# EAGLE design ardu_battle_2 (EAGLE 5.10)
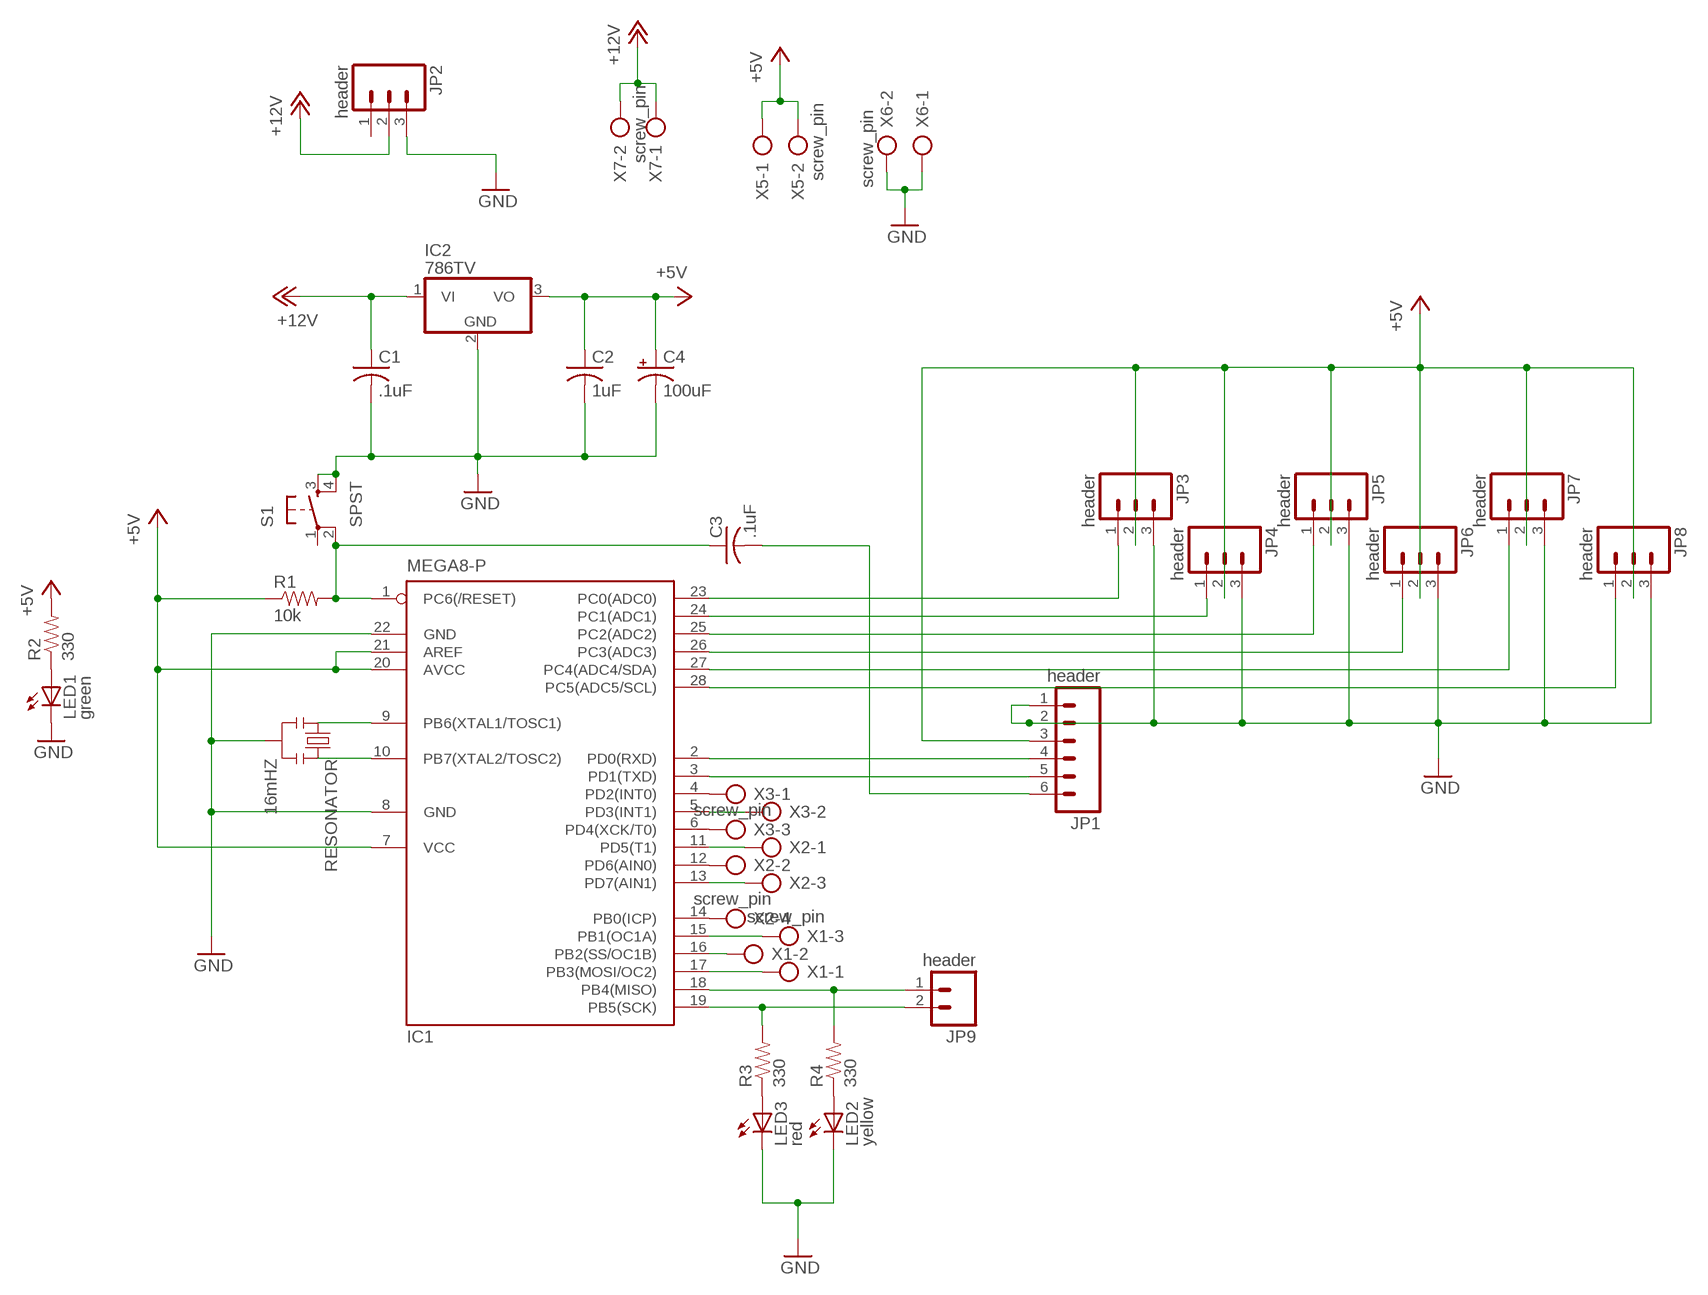
[diagram p0: schematic, sheet 1]

## Parts
C1  .1uF  C-US025-030X050  [C025-030X050]
C2  1uF  C-US025-030X050  [C025-030X050]
C3  .1uF  C-US075-032X103  [C075-032X103]
C4  100uF  CPOL-USE5-6  [E5-6]
IC1  MEGA8-P  [DIL28-3]
IC2  786TV  [TO220V]
JP1  header  M06SIP  [1X06]
JP2  header  M03PTH  [1X03]
JP3  header  M03PTH  [1X03]
JP4  header  M03PTH  [1X03]
JP5  header  M03PTH  [1X03]
JP6  header  M03PTH  [1X03]
JP7  header  M03PTH  [1X03]
JP8  header  M03PTH  [1X03]
JP9  header  M02PTH  [1X02]
LED1  green  LED3MM  [LED3MM]
LED2  yellow  LED3MM  [LED3MM]
LED3  red  LED3MM  [LED3MM]
R1  10k  RESISTORPTH-1/6W  [1/6W-RES]
R2  330  RESISTORPTH-1/6W  [1/6W-RES]
R3  330  RESISTORPTH-1/6W  [1/6W-RES]
R4  330  RESISTORPTH-1/6W  [1/6W-RES]
RESONATOR  16mHZ  RESONATORPTH  [RESONATOR-PTH]
S1  SPST  TAC_SWITCHPTH  [TACTILE-PTH]
X1  screw_pin  AK500/3  [AK500/3]
X2  screw_pin  AK500/4  [AK500/4]
X3  screw_pin  AK500/3  [AK500/3]
X5  screw_pin  AK500/2  [AK500/2]
X6  screw_pin  AK500/2  [AK500/2]
X7  screw_pin  AK500/2  [AK500/2]

## Nets
+5V: C2.1 C4.+ IC1.7(VCC) IC1.20(AVCC) IC1.21(AREF) IC2.3(VO) JP1.3 JP3.2 JP4.2 JP5.2 JP6.2 JP7.2 JP8.2 R1.1 R2.2 X5.1 X5.2
+12V: C1.1 IC2.1(VI) JP2.2 X7.1 X7.2
GND: C1.2 C2.2 C4.- IC1.8(GND) IC1.22(GND) IC2.2(GND) JP1.1 JP1.2 JP2.3 JP3.3 JP4.3 JP5.3 JP6.3 JP7.3 JP8.3 LED1.K(C) LED2.K(C) LED3.K(C) RESONATOR.2 S1.3 S1.4 X6.1 X6.2
N$1: IC1.10(PB7(XTAL2/TOSC2)) RESONATOR.3
N$2: IC1.9(PB6(XTAL1/TOSC1)) RESONATOR.1
N$3: IC1.23(PC0(ADC0)) JP3.1
N$4: IC1.24(PC1(ADC1)) JP4.1
N$5: C3.1 IC1.1(PC6(/RESET)) R1.2 S1.2
N$6: IC1.19(PB5(SCK)) JP9.2 R3.2
N$7: IC1.18(PB4(MISO)) JP9.1 R4.2
N$8: IC1.15(PB1(OC1A)) X1.3
N$9: IC1.25(PC2(ADC2)) JP5.1
N$10: IC1.26(PC3(ADC3)) JP6.1
N$11: IC1.27(PC4(ADC4/SDA)) JP7.1
N$12: IC1.28(PC5(ADC5/SCL)) JP8.1
N$13: IC1.16(PB2(SS/OC1B)) X1.2
N$14: IC1.17(PB3(MOSI/OC2)) X1.1
N$15: IC1.6(PD4(XCK/T0)) X3.3
N$16: IC1.4(PD2(INT0)) X3.1
N$17: IC1.12(PD6(AIN0)) X2.2
N$18: IC1.14(PB0(ICP)) X2.4
N$19: IC1.2(PD0(RXD)) JP1.4
N$20: IC1.3(PD1(TXD)) JP1.5
N$21: IC1.11(PD5(T1)) X2.1
N$22: IC1.13(PD7(AIN1)) X2.3
N$23: C3.2 JP1.6
N$24: LED1.A R2.1
N$25: LED3.A R3.1
N$26: LED2.A R4.1
N$30: IC1.5(PD3(INT1)) X3.2
Unconnected: JP2.1 S1.1

## Library data of the parts
C1-C3 = rcl:C-US: CAPACITOR, American symbol
C4 = rcl:CPOL-US: POLARIZED CAPACITOR, American symbol
IC1 = atmel:MEGA8-P: MICROCONTROLLER 8 Kbytes FLASH, 1 kbytes SRAM, 512 bytes EEPROM, USART, 4-channel 10 bit ADC, 2-channel 8 bit ADC Pin compatible with Atmega48, ATMega88, ATMega168 Source: avr.lbr
IC2 = linear:78*: Positive VOLTAGE REGULATOR Source: http://cache.national.com/ds/LM/LM78L05.pdf http://www.fairchildsemi.com/ds/LM/LM7805.pdf
JP1 = SparkFun:M06: Header 6 Standard 6-pin 0.1" header. Use with straight break away headers (SKU : PRT-00116), right angle break away headers (PRT-00553), swiss pins (PRT-00743), machine pins (PRT-00117), and female headers (PRT-00115). Molex polarized connector foot print use with SKU : PRT-08094 with associated crimp pins and housings. NOTES ON THE VARIANTS LOCK and LOCK_LONGPADS... This footprint was designed to help hold the alignment of a through-hole component (i.e. 6-pin header) while soldering it into place. You may notice that each hole has been shifted either up or down by 0.005 of an inch from it's more standard position (which is a perfectly straight line). This slight alteration caused the pins (the squares in the middle) to touch the edges of the holes. Because they are alternating, it causes a "brace" to hold the component in place. 0.005 has proven to be the perfect amount of "off-center" position when using our standard breakaway headers. Although looks a little odd when you look at the bare footprint, once you have a header in there, the alteration is very hard to notice. Also, if you push a header all the way into place, it is covered up entirely on the bottom side. This idea of altering the position of holes to aid alignment will be further integrated into the Sparkfun Library for other footprints. It can help hold any component with 3 or more connection pins.
JP2-JP8 = SparkFun:M03: Header 3 Standard 3-pin 0.1" header. Use with straight break away headers (SKU : PRT-00116), right angle break away headers (PRT-00553), swiss pins (PRT-00743), machine pins (PRT-00117), and female headers (PRT-00115). Molex polarized connector foot print use with SKU : PRT-08232 with associated crimp pins and housings.
JP9 = SparkFun:M02: Header 2 Standard 2-pin 0.1" header. Use with straight break away headers (SKU : PRT-00116), right angle break away headers (PRT-00553), swiss pins (PRT-00743), machine pins (PRT-00117), and female headers (PRT-00115). Molex polarized connector foot print use with SKU : PRT-08233 with associated crimp pins and housings.
LED1-LED3 = SparkFun:LED: LEDs Standard schematic elements and footprints for 5mm, 3mm, 1206, and 0603 sized LEDs. 5mm - Spark Fun Electronics SKU : COM-00529 (and others)
R1-R4 = SparkFun:RESISTOR: Resistor Basic schematic elements and footprints for 0603, 1206, and PTH 1/10th watt (small) resistors.
RESONATOR = SparkFun:RESONATOR: Resonator Small SMD resonator. This is the itty bitty 10/20MHz resonators with built in caps. CSTCE10M0G55 and CSTCE20M0V53. Footprint has been reviewed closely but hasn't been tested yet.
S1 = SparkFun:TAC_SWITCH: Momentary Switch Button commonly used for reset or general input. Spark Fun Electronics SKU : COM-00097
X1 X3 = con-ptr500:AK500/3: CONNECTOR
X2 = con-ptr500:AK500/4: CONNECTOR
X5-X7 = con-ptr500:AK500/2: CONNECTOR

## Board
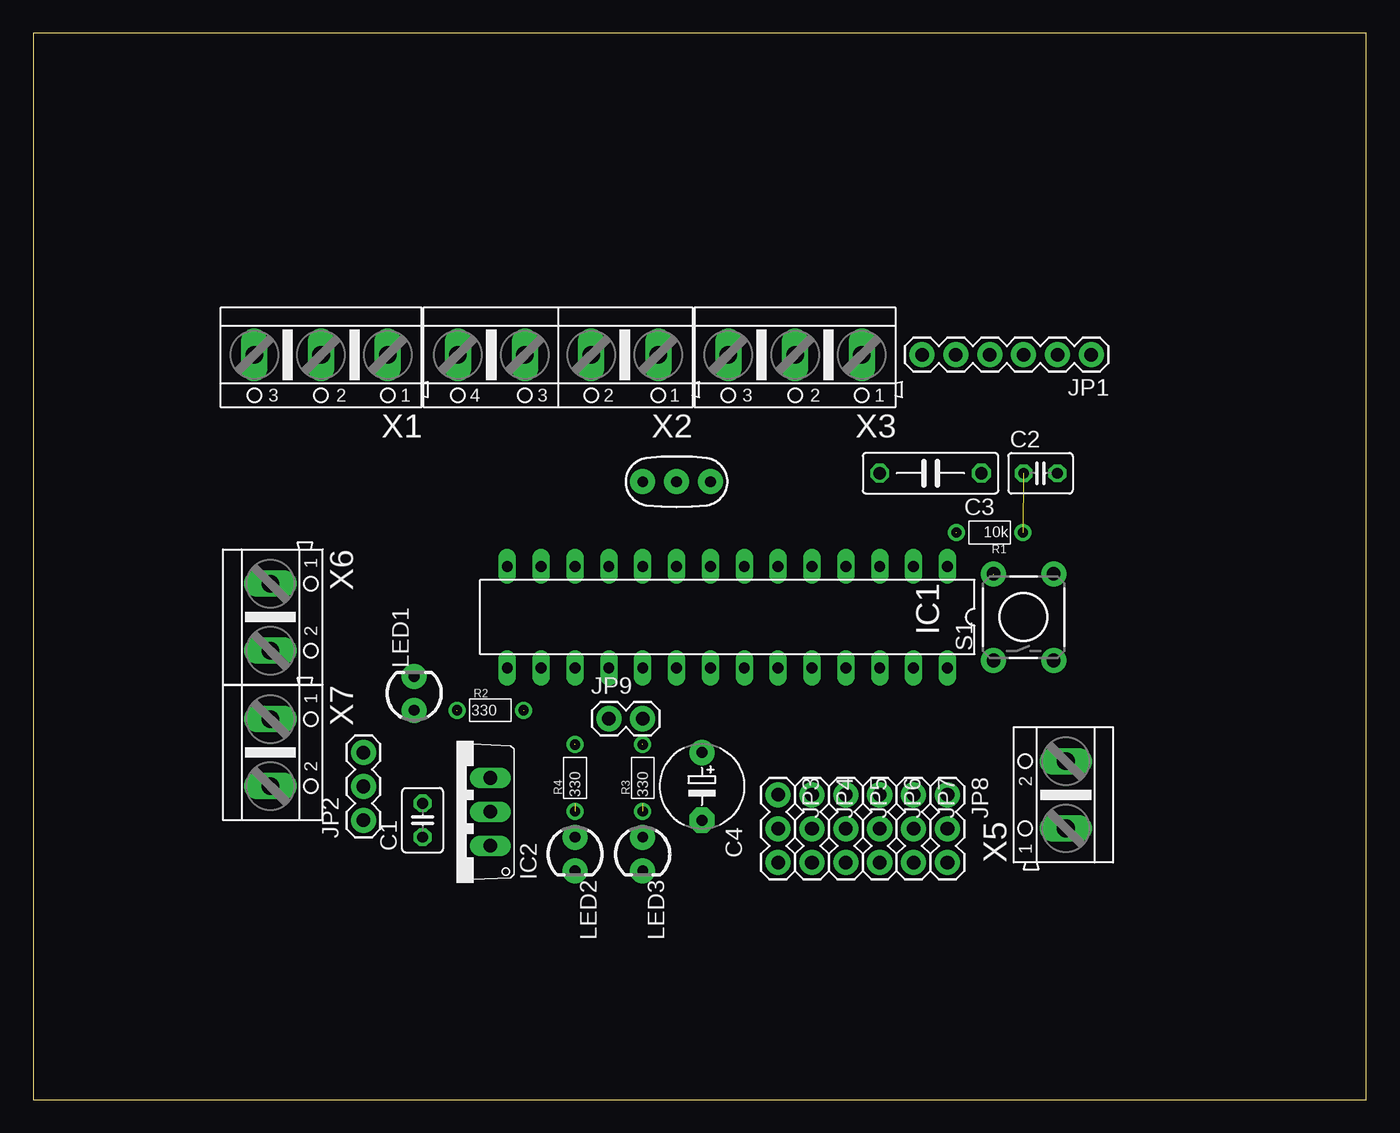
[diagram p1: board, top side]
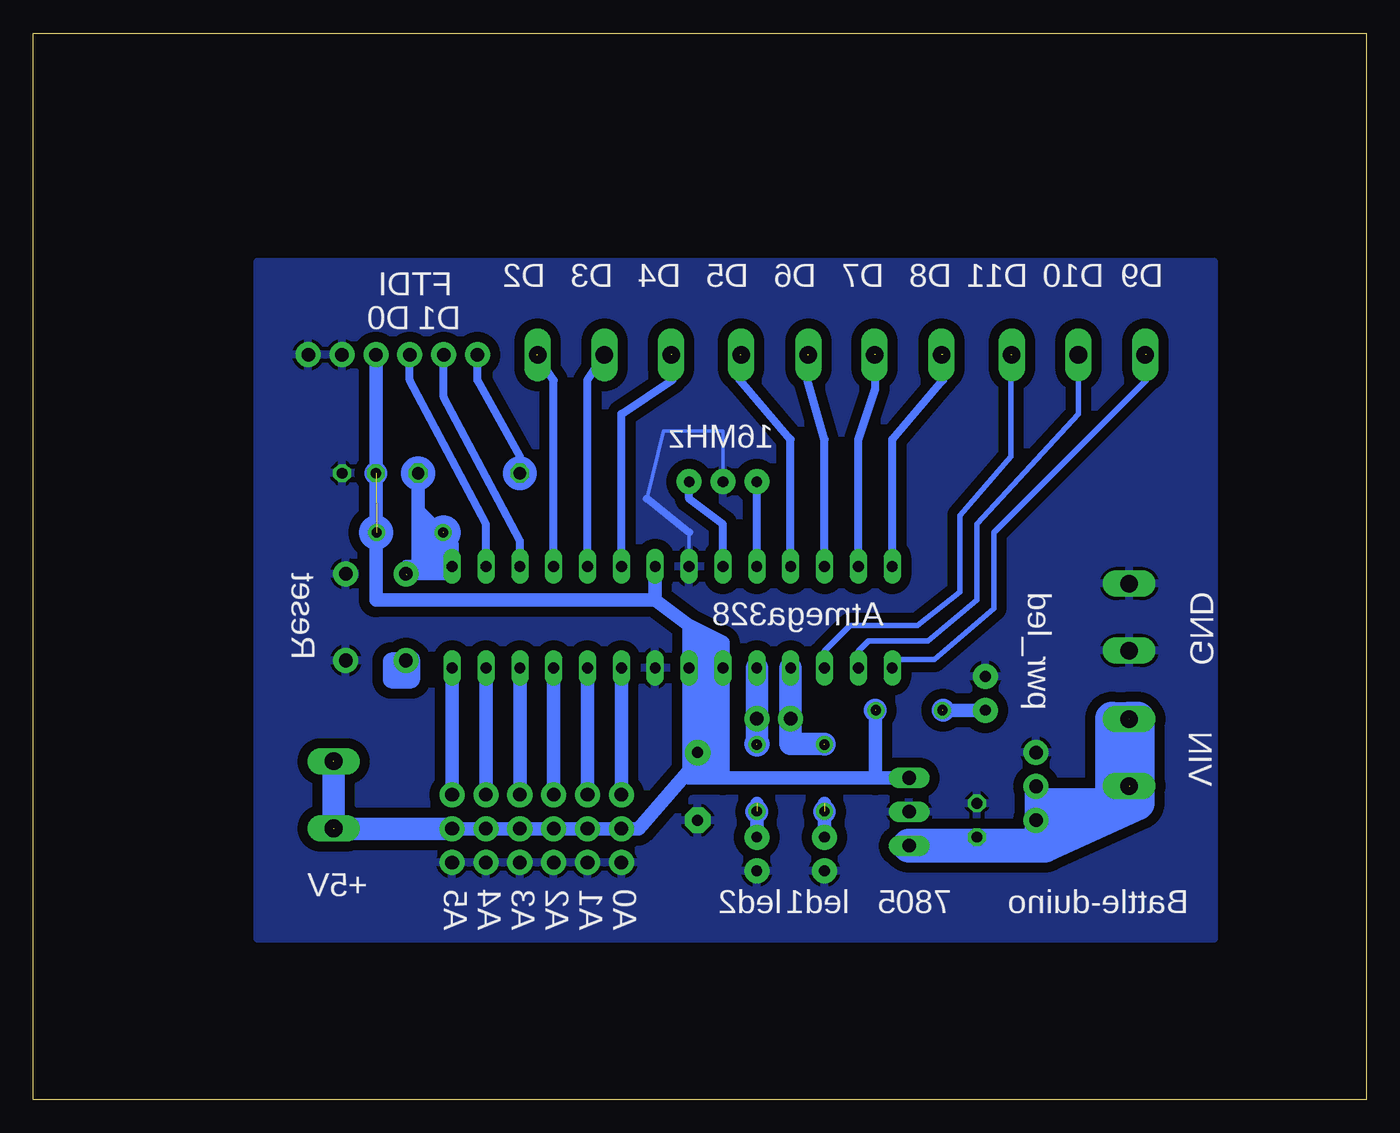
[diagram p2: board, bottom side, seen from below]

Size 100 x 80 mm. Coordinates in mm from the lower left corner, seen from the top.
Outline: 0,0 100,0 100,80 0,80 0,0
Copper layers (1*16): Top 0.035mm / dielectric 1.5mm / Bottom 0.035mm
Design rules "default *": minimum track width 10mil, minimum drill 24mil, track to track 30mil, track to pad 30mil, pad to pad 8mil, via to via 8mil, smd to smd 8mil, copper to edge 40mil, drill to drill 8mil, minimum pad ring 10mil, minimum via ring 8mil, stop-mask expansion 4mil, vias tented up to drill 0mil, thermal gap 10mil

### Footprints (pad centres in the part's own frame; a part is rotated, then mirrored left to right if it is on the bottom)
C025-030X050 = drill 0.813 octagon: 1 -1.27,0; 2 1.27,0
C075-032X103 = drill 0.914 octagon: 1 -3.81,0; 2 3.81,0
E5-6 = drill 0.813 pad 1.905 round: + -2.54,0 | drill 0.813 pad 1.905 octagon: - 2.54,0
DIL28-3 = drill 0.813 long: 1 -16.51,-3.81; 2 -13.97,-3.81; 3 -11.43,-3.81; 4 -8.89,-3.81; 5 -6.35,-3.81; 6 -3.81,-3.81; 7 -1.27,-3.81; 8 1.27,-3.81; 9 3.81,-3.81; 10 6.35,-3.81; 11 8.89,-3.81; 12 11.43,-3.81; 13 13.97,-3.81; 14 16.51,-3.81; 15 16.51,3.81; 16 13.97,3.81; 17 11.43,3.81; 18 8.89,3.81; 19 6.35,3.81; 20 3.81,3.81; 21 1.27,3.81; 22 -1.27,3.81; 23 -3.81,3.81; 24 -6.35,3.81; 25 -8.89,3.81; 26 -11.43,3.81; 27 -13.97,3.81; 28 -16.51,3.81
TO220V = drill 1.016 long: 1 -2.54,-2.54; 2 0,-2.54; 3 2.54,-2.54
1X06 = drill 1.016 pad 1.88 round: 1 0,0; 2 2.54,0; 3 5.08,0; 4 7.62,0; 5 10.16,0; 6 12.7,0
1X03 = drill 1.016 pad 1.88 round: 1 0,0; 2 2.54,0; 3 5.08,0
1X02 = drill 1.016 pad 1.88 round: 1 0,0; 2 2.54,0
LED3MM = drill 0.813 pad 1.88 round: A -1.27,0; K 1.27,0
1/6W-RES = drill 0.762 round: 1 -2.5,0; 2 2.5,0
RESONATOR-PTH = drill 0.8 pad 1.88 round: 1 -2.54,0; 2 0,0; 3 2.54,0
TACTILE-PTH = drill 1.016 pad 1.88 round: 1 -3.251,2.261; 2 3.251,2.261; 3 -3.251,-2.261; 4 3.251,-2.261
AK500/3 = drill 1.321 long: 1 -5.004,0; 2 0,0; 3 5.004,0
AK500/4 = drill 1.321 long: 1 -7.518,0; 2 -2.489,0; 3 2.489,0; 4 7.518,0
AK500/2 = drill 1.321 long: 1 -2.515,0; 2 2.515,0

### Placement (x,y rotation side)
C1  29.21,20.95 90 top
C2  75.56,46.99 0 top
C3  67.31,46.99 180 top
C4  50.16,23.5 270 top
IC1  52.07,36.2 180 top
IC2  31.75,21.59 90 top
JP1  79.38,55.88 180 top
JP2  24.77,20.95 90 top
JP3  55.88,22.86 270 top
JP4  58.42,22.86 270 top
JP5  60.96,22.86 270 top
JP6  63.5,22.86 270 top
JP7  66.04,22.86 270 top
JP8  68.58,22.86 270 top
JP9  43.18,28.57 0 top
LED1  28.57,30.48 90 top
LED2  40.64,18.41 270 top
LED3  45.72,18.41 270 top
R1  71.75,42.55 180 top
R2  34.29,29.21 0 top
R3  45.72,24.13 90 top
R4  40.64,24.13 90 top
RESONATOR  48.26,46.35 180 top
S1  74.3,36.2 90 top
X1  21.59,55.88 180 top
X2  39.37,55.88 180 top
X3  57.15,55.88 180 top
X5  77.47,22.86 90 top
X6  17.78,36.2 270 top
X7  17.78,26.04 270 top

### Tracks (layer width: path | path; a pad name or v marks a point on that pad's centre or on a via)
+5V  (4 unrouted)
  Bottom 1.016: 50.8,35.56 53.34,37.47 | 53.34,37.47 IC1.7 | JP8.2 JP7.2 JP6.2 JP5.2 JP4.2 JP3.2 54.61,20.32 50.16,25.4 | 48.26,34.29 50.8,35.56 | 48.26,34.29 48.26,33.02 50.8,33.02 50.8,34.92 | 48.9,34.29 50.8,34.92 | 48.9,34.29 48.9,33.66 50.16,33.66 50.8,35.56 | 50.8,35.56 50.8,34.92 | 50.8,34.92 50.16,34.29 48.9,34.29 | 48.26,34.29 48.9,34.29 | IC1.21 48.26,34.29 | 50.16,32.38 IC1.21 | 49.53,32.38 50.16,32.38 | 48.9,32.38 IC1.20 48.26,24.77 | 50.8,24.77 C4.+ | 50.16,25.4 C4.+ | 53.34,37.47 74.3,37.47 C2.1 JP1.3 | IC2.3 36.83,24.13 | 48.9,24.77 49.53,24.77 | 50.16,24.77 50.8,24.77 | 50.8,24.77 IC1.21 | 49.53,27.94 48.26,24.77 | 48.26,24.13 48.9,24.77 | 48.9,24.77 48.26,24.77 | 48.26,24.77 48.9,32.38 | 48.9,32.38 49.53,32.38 | 49.53,27.94 49.53,24.77 | 49.53,27.94 49.53,32.38 | 49.53,24.77 50.16,24.77 | 50.16,24.77 50.16,25.4 | 50.16,32.38 C4.+ | 48.26,24.13 50.8,24.13 | 48.26,24.13 49.53,27.94 | 48.26,24.13 48.26,24.77 | 36.83,24.13 48.26,24.13 | 36.83,24.13 36.83,29.21
  Bottom 1.676: JP8.2 77.47,20.32 77.47,25.4
+12V  (2 unrouted)
  Bottom 1.016: IC2.1 C1.1 24.77,19.05 24.77,19.68 | 17.78,22.23 18.41,22.86 24.77,22.86
  Bottom 1.676: JP2.2 24.77,22.86 24.77,19.68 24.13,19.68 20.95,20.95 | 20.95,20.95 19.05,20.95 19.68,21.59 24.13,21.59 24.77,20.95 20.95,20.95 | 17.78,23.5 17.78,22.23 20.95,20.95
  Bottom 1.778: 24.13,19.68 24.77,19.05 20.95,20.95 18.41,22.86 17.78,23.5
  Bottom 2.54: 17.78,28.57 17.14,28.57 17.14,22.23 | 17.14,22.23 19.05,22.86 19.05,28.57 17.78,28.57 | 17.78,28.57 17.78,23.5 17.78,22.86 17.14,22.23 | 17.14,22.23 24.13,19.05 24.77,19.05 IC2.1
GND
  Bottom 0.254: 53.98,45.09 52.7,50.16 48.26,50.16 RESONATOR.2 | IC1.8 50.8,42.55
  Bottom 0.61: 50.8,42.55 53.98,45.09
  pour Bottom: 11.43,62.87 11.43,12.06 83.19,12.06 83.19,62.87
N$1
  Bottom 0.61: IC1.10 RESONATOR.3
N$2
  Bottom 0.61: IC1.9 48.26,43.18 50.8,45.09 RESONATOR.1
N$3
  Bottom 1.016: JP3.1 IC1.23
N$4
  Bottom 1.016: JP4.1 IC1.24
N$5  (2 unrouted)
  Bottom 0.406: 69.22,42.55 68.58,41.91 IC1.1 68.58,39.88
  Bottom 0.813: IC1.1 68.58,39.37 71.75,39.37
  Bottom 1.016: 71.12,44.2 68.58,41.66 IC1.1 71.12,40.01 | 71.12,40.01 72.01,40.01 72.01,39.37 | 71.12,40.01 71.12,40.64 | 71.12,44.2 C3.1 | 71.12,40.64 71.12,44.2 | 71.12,40.64 69.22,40.64 69.22,41.91 70.48,43.18 70.48,41.27 69.85,41.27 69.85,41.91
N$6  (1 unrouted)
  Bottom 1.676: 45.72,26.67 JP9.2 IC1.19
N$7  (1 unrouted)
  Bottom 1.676: 40.64,26.67 43.18,26.67 JP9.1 IC1.18
N$8  (1 unrouted)
  Bottom 0.406: 35.56,33.02 32.38,33.02 27.94,36.83 27.94,42.55 16.51,53.98 16.51,55.88
  Bottom 0.61: 35.56,33.02 IC1.15
N$9
  Bottom 1.016: JP5.1 IC1.25
N$10
  Bottom 1.016: JP6.1 IC1.26
N$11
  Bottom 1.016: JP7.1 IC1.27
N$12
  Bottom 1.016: JP8.1 IC1.28
N$13
  Bottom 0.406: IC1.16 38.1,33.66 37.34,34.42 32.89,34.42 29.21,37.47 29.21,43.18 21.59,51.44 X1.2
N$14  (1 unrouted)
  Bottom 0.406: 26.67,55.88 26.67,48.26 30.48,43.81 30.48,38.1 33.66,35.56 38.73,35.56 40.64,33.66 IC1.17
N$15  (1 unrouted)
  Bottom 0.61: 52.07,55.88 52.07,53.98 55.88,51.44 IC1.6
N$16  (1 unrouted)
  Bottom 0.61: IC1.4 60.96,53.98 62.23,55.88
N$17  (1 unrouted)
  Bottom 0.61: IC1.12 40.64,49.53 41.91,53.98 41.91,55.88
N$18  (1 unrouted)
  Bottom 0.61: 31.75,55.88 31.75,53.98 35.56,49.53 IC1.14
N$19
  Bottom 0.61: JP1.4 71.75,53.98 66.04,43.18 IC1.2
N$20
  Bottom 0.61: IC1.3 63.5,41.91 69.22,52.7 JP1.5
N$21  (1 unrouted)
  Bottom 0.61: 46.99,55.88 46.99,53.98 43.18,49.53 IC1.11
N$22  (1 unrouted)
  Bottom 0.61: 36.83,55.88 36.83,53.34 38.1,49.53 IC1.13
N$23
  Bottom 0.61: C3.2 63.5,48.26 66.67,53.98 JP1.6
N$24  (1 unrouted)
  Bottom 1.016: LED1.A 31.75,29.21
N$25  (1 unrouted)
  Bottom 1.016: LED3.A 45.72,22.23
N$26  (1 unrouted)
  Bottom 1.016: LED2.A 40.64,22.23
N$27
  Bottom 1.27: 72.01,33.02 72.39,33.02 | 72.01,32.89 72.01,33.02 | 72.01,32.89 73.15,32.89 73.15,31.5 71.63,31.5 71.63,33.02 72.01,33.02 | 72.01,32.89 72.01,32.38
N$30
  Bottom 0.61: IC1.5 58.42,53.98 X3.2
(copper drawn outside any net)
  shapes: Bottom circle x14

### Text on the board
bPlace: D9 | D10 | D11 | D8 | D7 | D6 | D5 | D4 | D3 | D2 | FTDI | D1 | D0 | 16MHz | GND | Atmega328 | Reset | pwr_led | VIN | +5V | Battle-duino | 7805 | led1 | led2 | A0 | A1 | A2 | A3 | A4 | A5